# Altium schematic sheet 1- balenaFin HAT Cover.SchDoc
size A
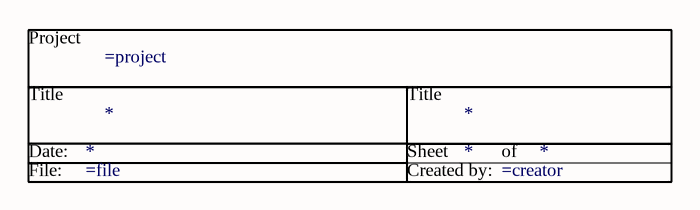
[diagram p0: 1- balenaFin HAT Cover.SchDoc]

## Parts
*  Title_Block  (value not drawn)  (graphical)

## Notes on the sheet
- (in symbol Title_Block) Project; Title; Date:; Sheet; of; File:; Created by: